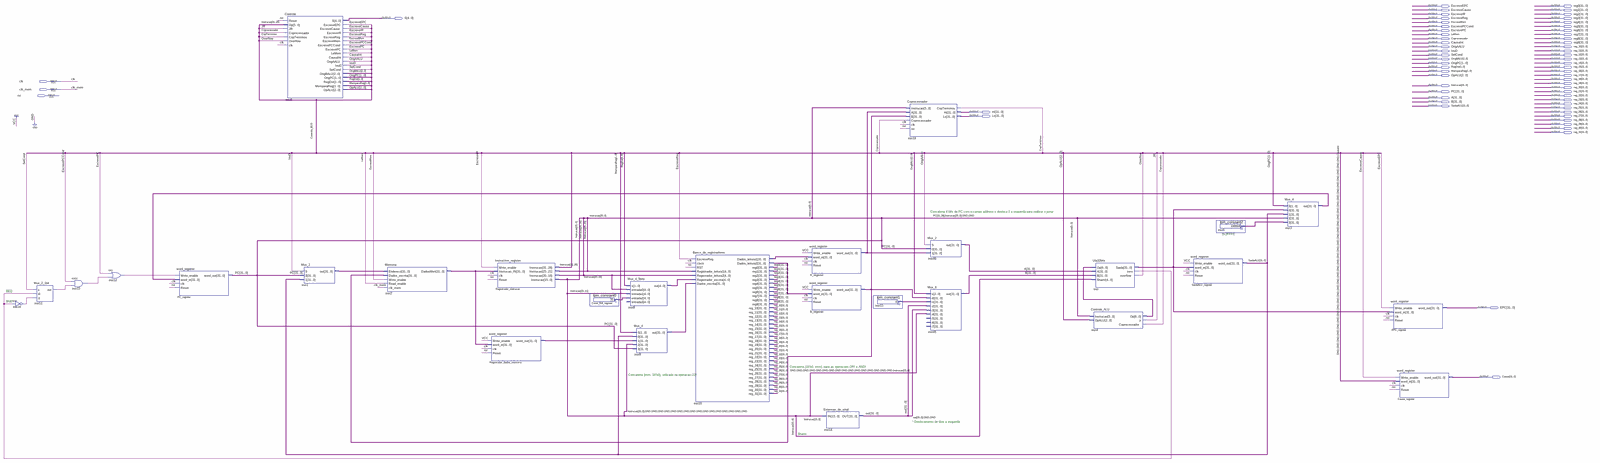
[diagram p0: schematic sheet, whole]
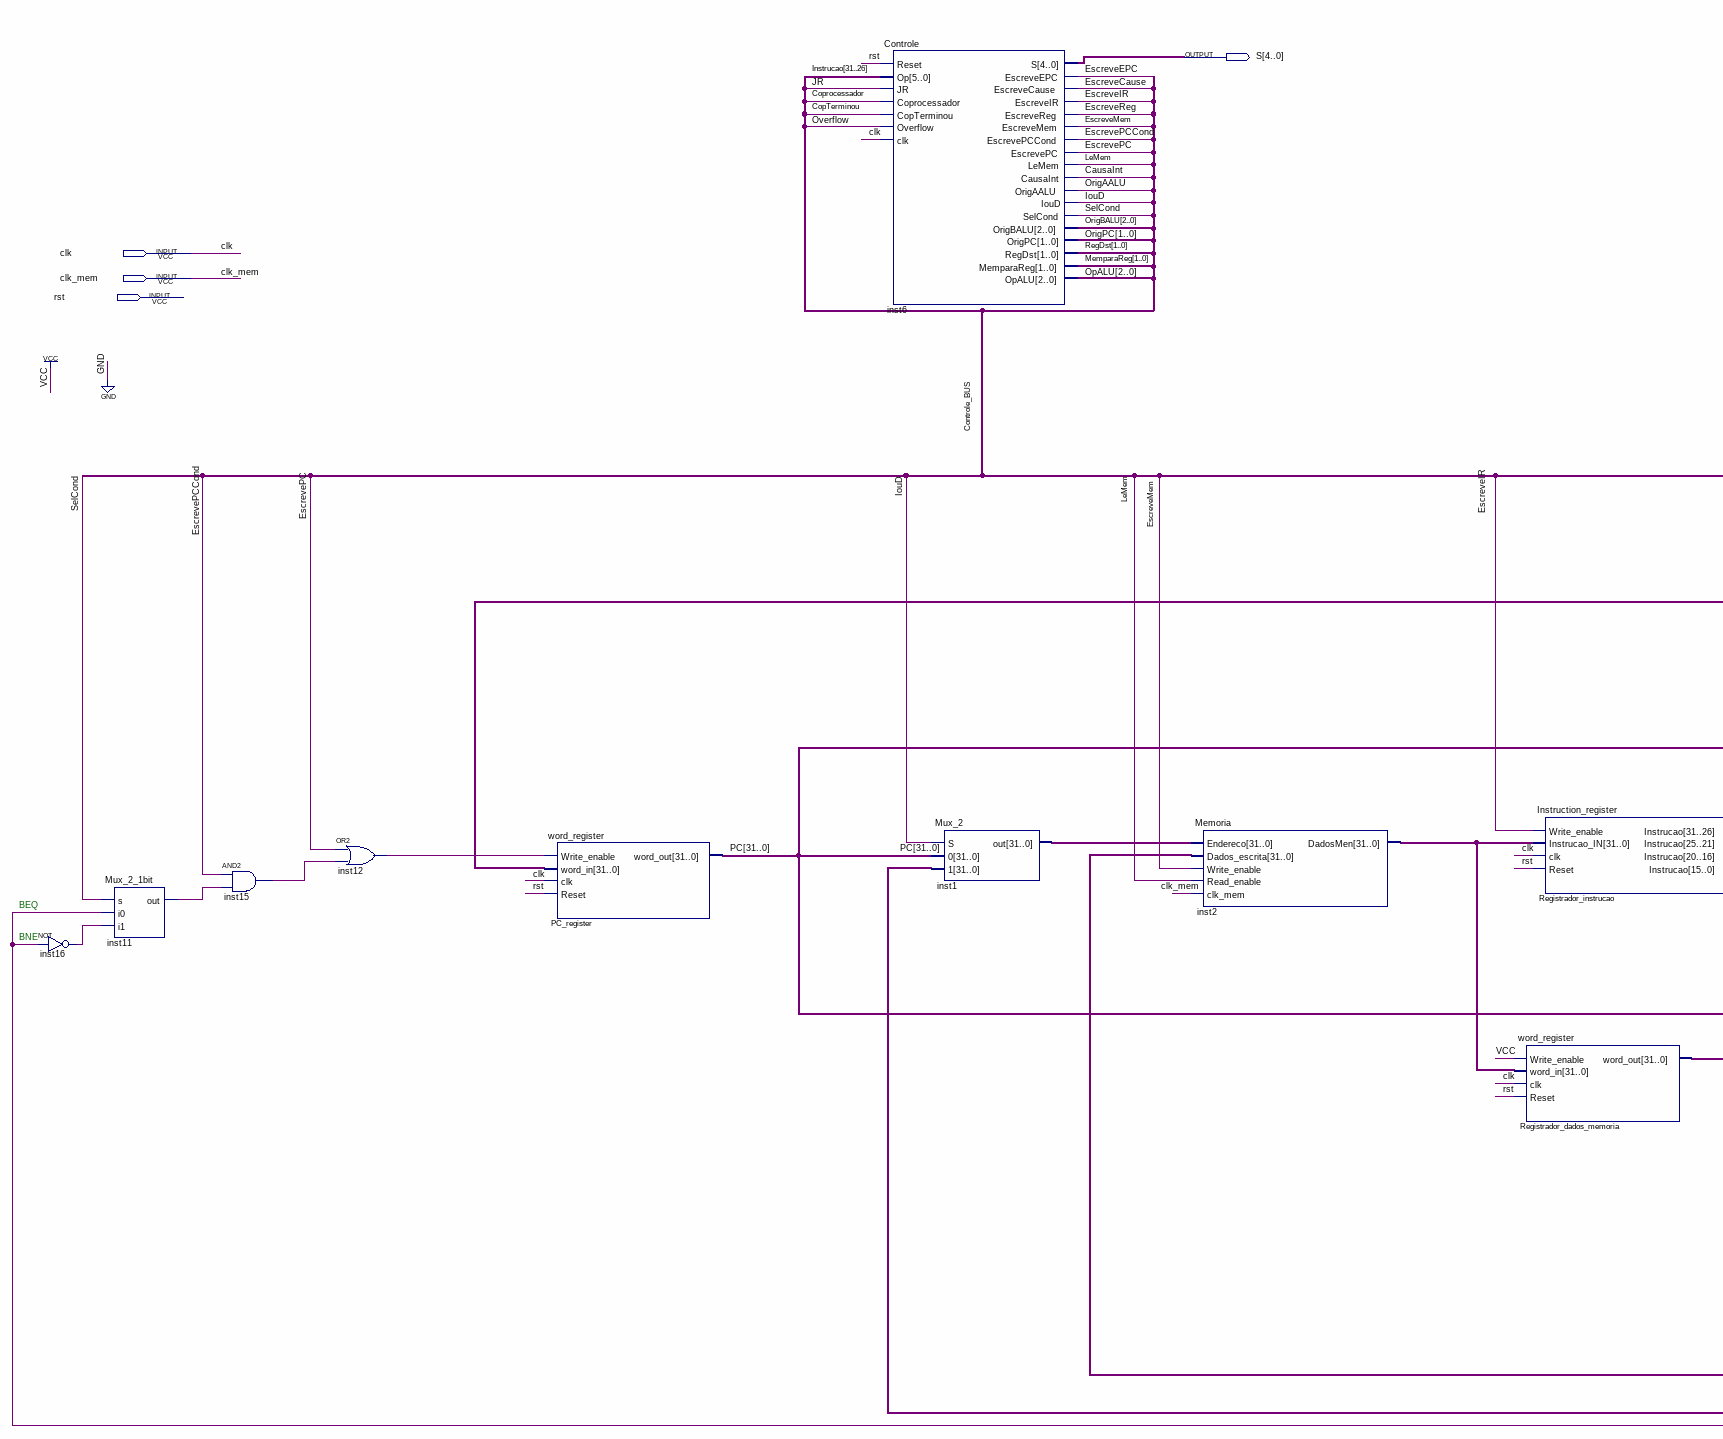
[diagram p1: schematic sheet, left part]
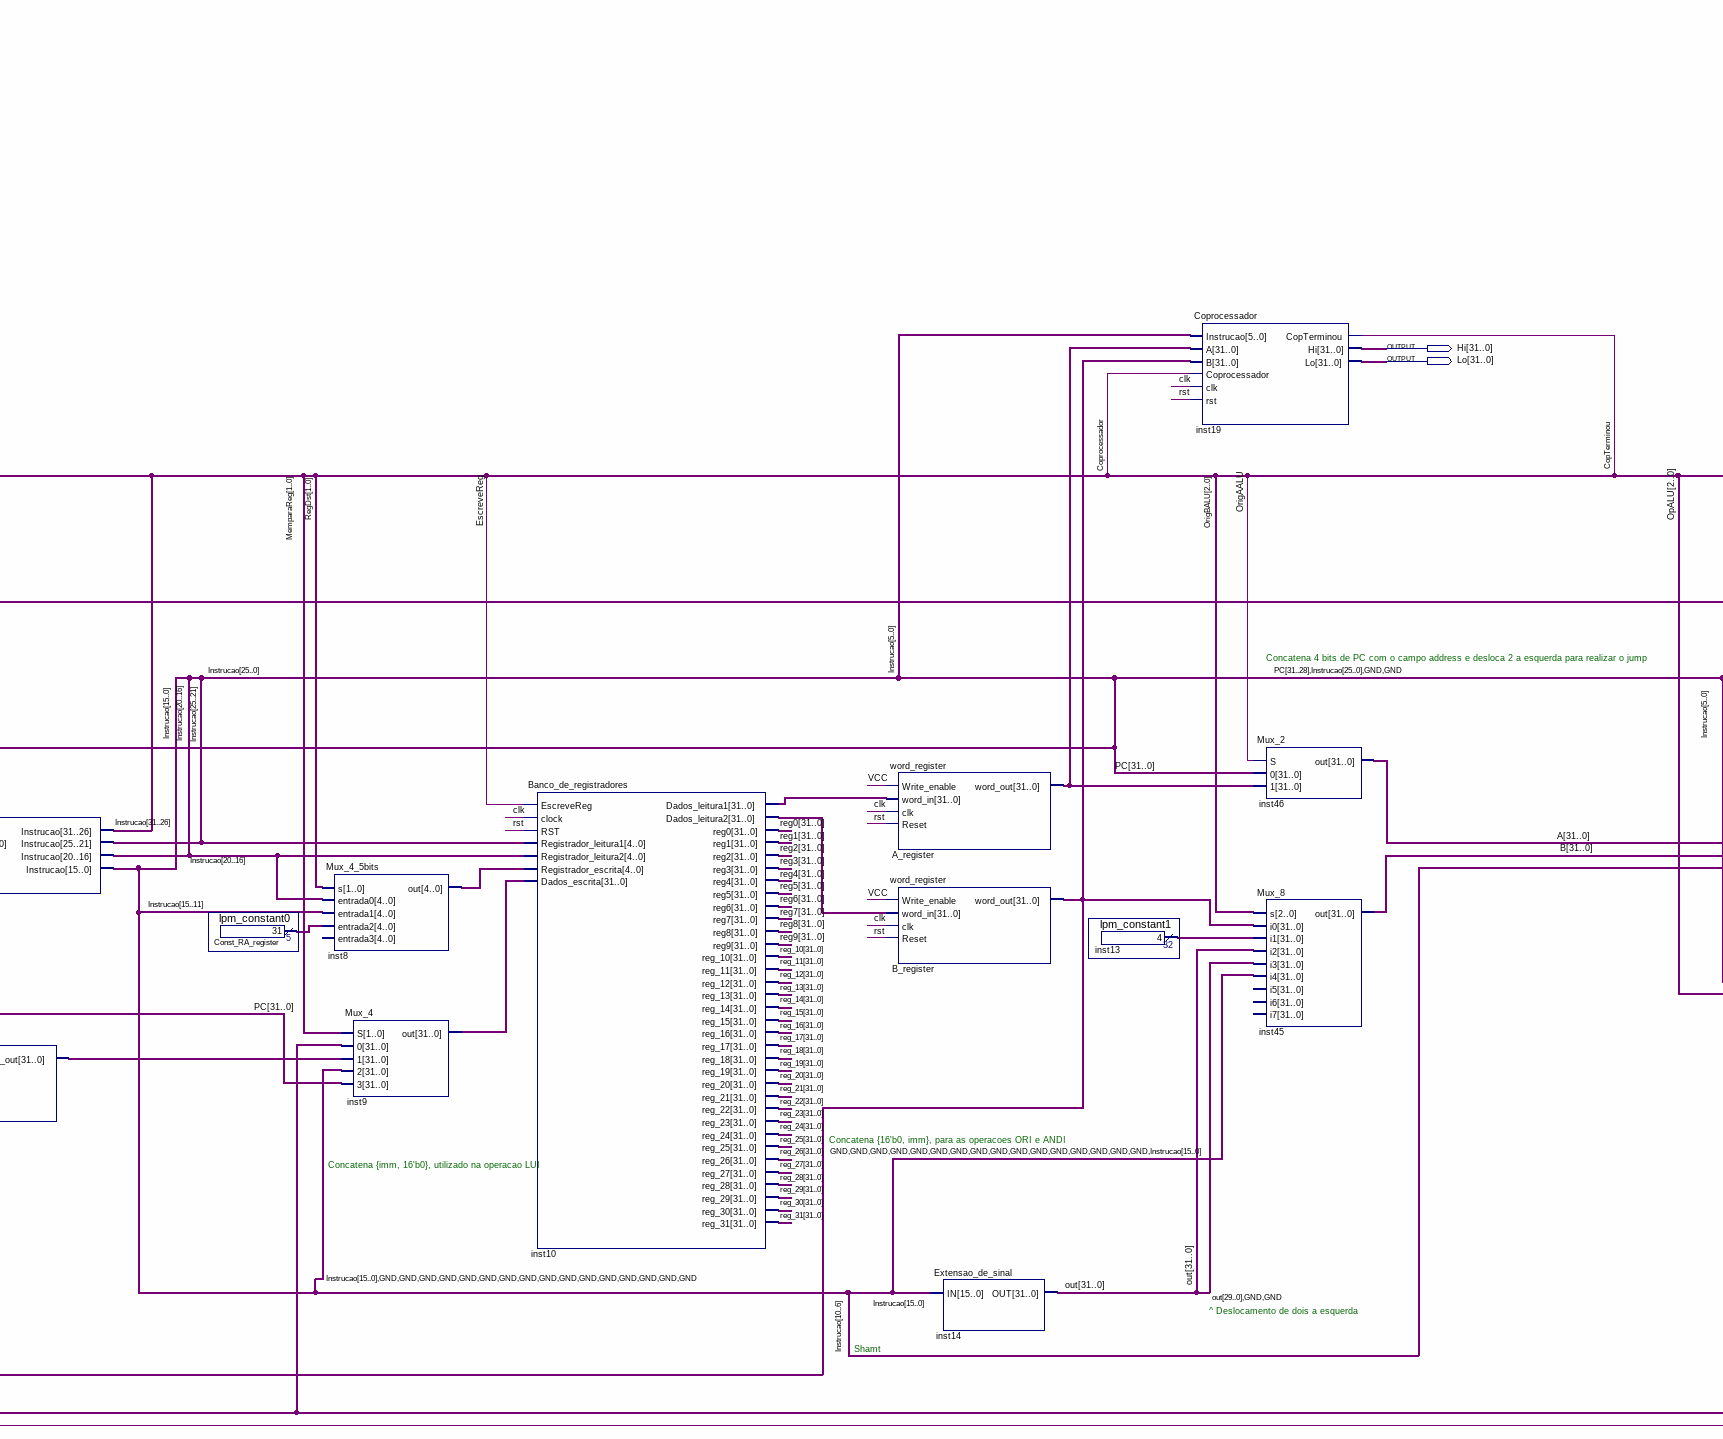
[diagram p2: schematic sheet, centre part]
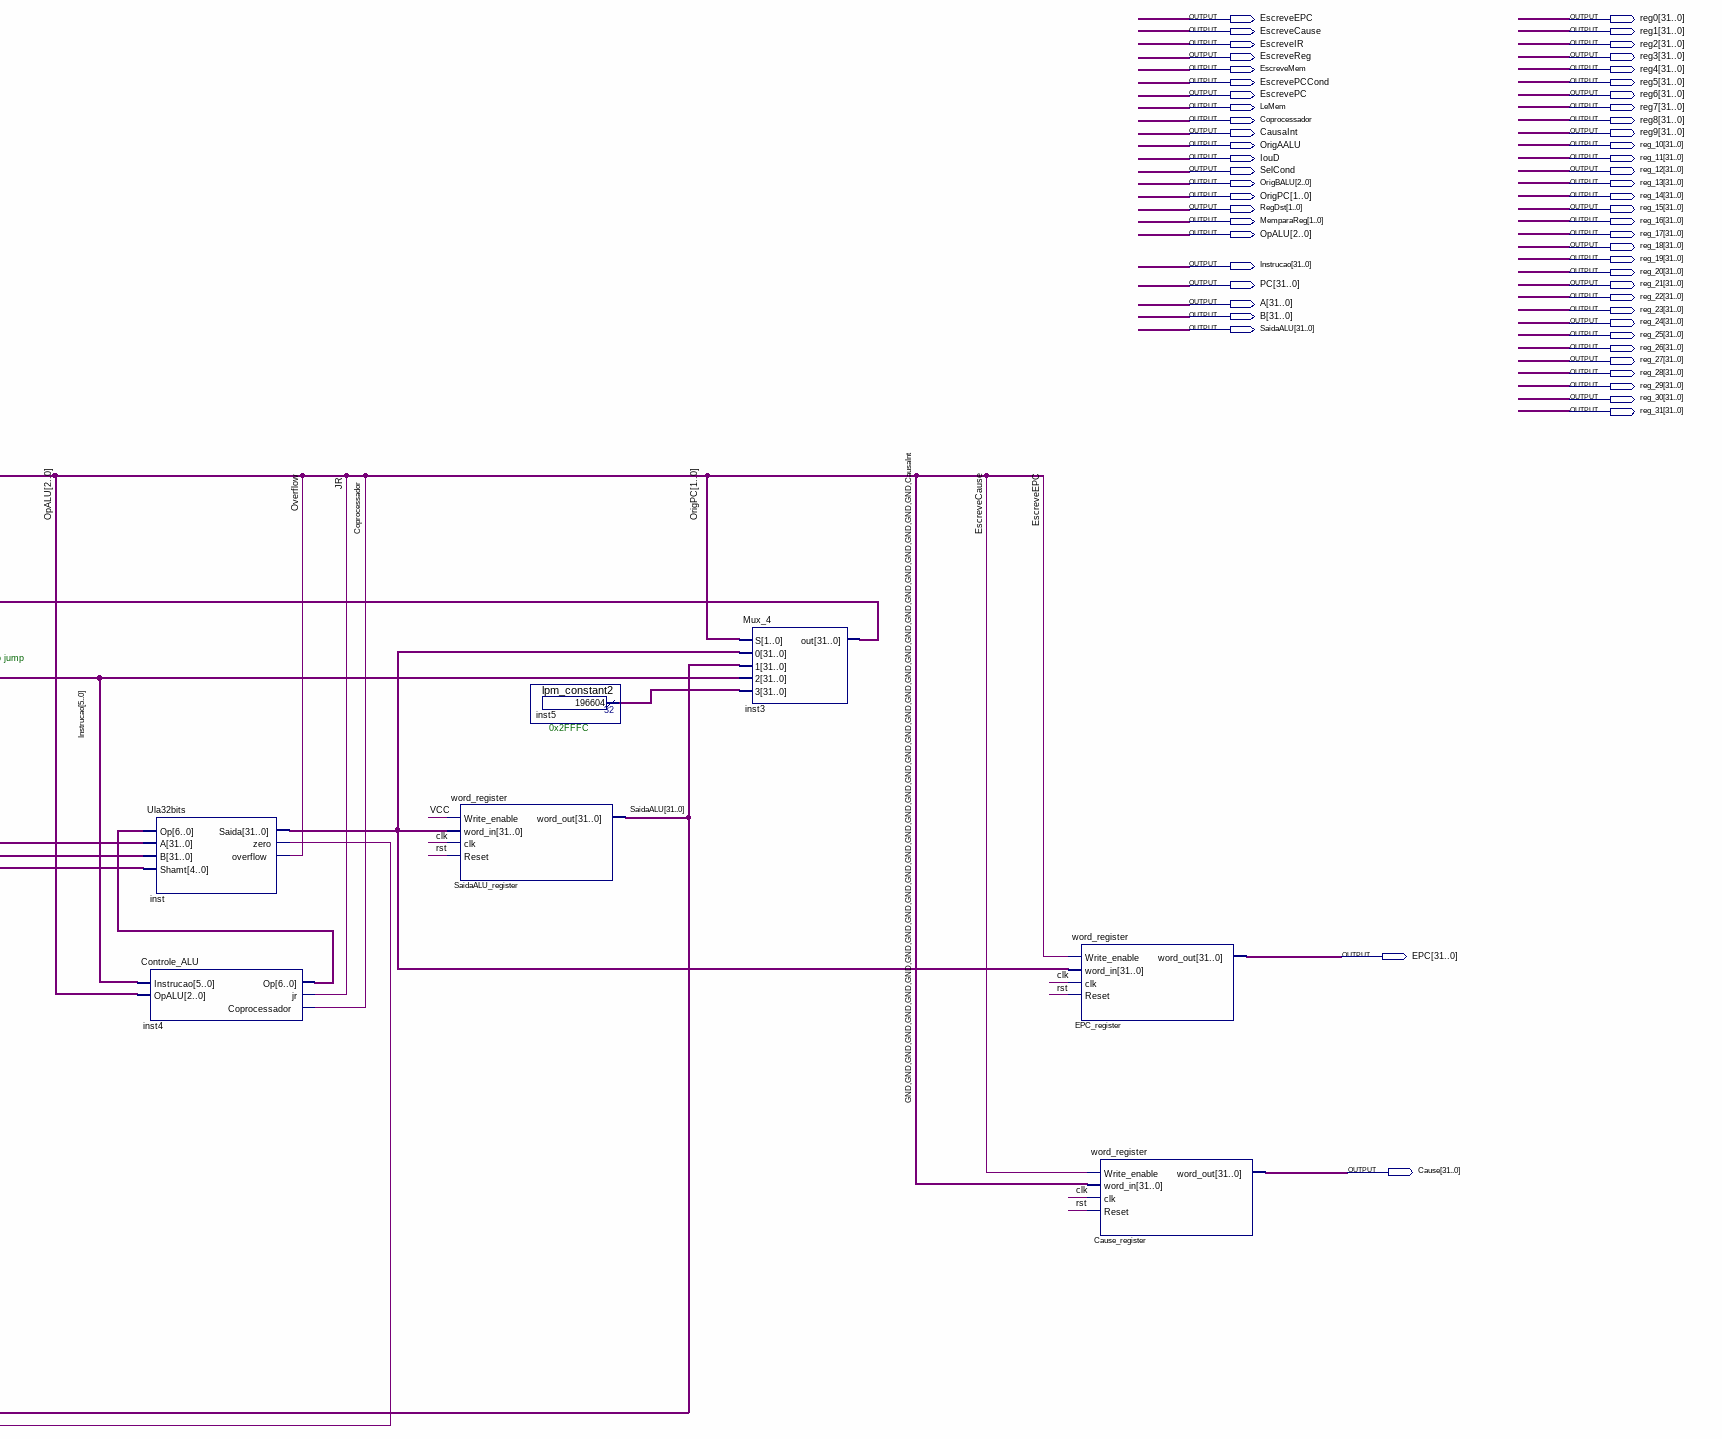
[diagram p3: schematic sheet, right part]
// Quartus schematic MIPS_Multiciclo.bdf as structural Verilog: 28 symbols, 63 pins
module MIPS_Multiciclo (
  input  clk,
  input  clk_mem,
  input  rst,
  output EscreveEPC,
  output [31:0] reg0,
  output EscreveCause,
  output [31:0] reg1,
  output EscreveIR,
  output [31:0] reg2,
  output [4:0] S,
  output EscreveReg,
  output [31:0] reg3,
  output EscreveMem,
  output [31:0] reg4,
  output EscrevePCCond,
  output [31:0] reg5,
  output EscrevePC,
  output [31:0] reg6,
  output LeMem,
  output [31:0] reg7,
  output Coprocessador,
  output [31:0] reg8,
  output CausaInt,
  output [31:0] reg9,
  output OrigAALU,
  output [31:0] reg_10,
  output IouD,
  output [31:0] reg_11,
  output SelCond,
  output [31:0] reg_12,
  output [2:0] OrigBALU,
  output [31:0] reg_13,
  output [1:0] OrigPC,
  output [31:0] reg_14,
  output [1:0] RegDst,
  output [31:0] reg_15,
  output [1:0] MemparaReg,
  output [31:0] reg_16,
  output [2:0] OpALU,
  output [31:0] reg_17,
  output [31:0] reg_18,
  output [31:0] reg_19,
  output [31:0] Instrucao,
  output [31:0] reg_20,
  output [31:0] PC,
  output [31:0] reg_21,
  output [31:0] reg_22,
  output [31:0] A,
  output [31:0] reg_23,
  output [31:0] B,
  output [31:0] reg_24,
  output [31:0] SaidaALU,
  output [31:0] reg_25,
  output [31:0] Hi,
  output [31:0] reg_26,
  output [31:0] Lo,
  output [31:0] reg_27,
  output [31:0] reg_28,
  output [31:0] reg_29,
  output [31:0] reg_30,
  output [31:0] reg_31,
  output [31:0] EPC,
  output [31:0] Cause
);

  wire CopTerminou, GND, inst11_out, inst12_out, inst15_out, inst16_out, inst_zero, JR, Overflow;
  wire [4:0] Const_RA_register_result, inst8_out;
  wire [6:0] inst4_op;
  wire [31:0] A_register_word_out, B_register_word_out, inst1_out, inst2_dadosmen, inst3_out, inst5_result,
       inst9_out, inst10_dados_leitura1, inst10_dados_leitura2, inst13_result, inst_saida, out,
       Registrador_dados_memoria_word_out;
  wire [31:0] Registrador_instrucao_instrucao_open;  // unused outputs

  not inst16 (inst16_out, inst_zero);
  Mux_2_1bit inst11 (.s(SelCond), .i0(inst_zero), .i1(inst16_out), .out(inst11_out));
  and inst15 (inst15_out, EscrevePCCond, inst11_out);
  or inst12 (inst12_out, EscrevePC, inst15_out);
  word_register PC_register (.Write_enable(inst12_out), .word_in(inst3_out), .clk(clk), .Reset(rst), .word_out(PC));
  Controle inst6 (
    .Reset(rst), .Op(Instrucao[31:26]), .JR(JR), .Coprocessador(Coprocessador), .CopTerminou(CopTerminou),
    .Overflow(Overflow), .clk(clk), .S(S), .EscreveEPC(EscreveEPC), .EscreveCause(EscreveCause),
    .EscreveIR(EscreveIR), .EscreveReg(EscreveReg), .EscreveMem(EscreveMem), .EscrevePCCond(EscrevePCCond),
    .EscrevePC(EscrevePC), .LeMem(LeMem), .CausaInt(CausaInt), .OrigAALU(OrigAALU), .IouD(IouD),
    .SelCond(SelCond), .OrigBALU(OrigBALU), .OrigPC(OrigPC), .RegDst(RegDst), .MemparaReg(MemparaReg),
    .OpALU(OpALU));
  Mux_2 inst1 (.S(IouD), .\0 (PC), .\1 (SaidaALU), .out(inst1_out));
  Memoria inst2 (
    .Endereco(inst1_out), .Dados_escrita(B_register_word_out), .Write_enable(EscreveMem),
    .Read_enable(LeMem), .clk_mem(clk_mem), .DadosMen(inst2_dadosmen));
  Instruction_register Registrador_instrucao (
    .Write_enable(EscreveIR), .Instrucao_IN(inst2_dadosmen), .clk(clk), .Reset(rst),
    .Instrucao({Instrucao[31:16], Registrador_instrucao_instrucao_open[15:0]}));
  word_register Registrador_dados_memoria (
    .Write_enable(1'b1), .word_in(inst2_dadosmen), .clk(clk), .Reset(rst),
    .word_out(Registrador_dados_memoria_word_out));
  lpm_constant0 Const_RA_register (.result(Const_RA_register_result));
  Mux_4_5bits inst8 (
    .s(RegDst), .entrada0(Instrucao[20:16]), .entrada1(Instrucao[15:11]),
    .entrada2(Const_RA_register_result), .out(inst8_out));  // open: entrada3
  Mux_4 inst9 (
    .S(MemparaReg), .\0 (SaidaALU), .\1 (Registrador_dados_memoria_word_out),
    .\2 ({Instrucao[15:0], {16{GND}}}), .\3 (PC), .out(inst9_out));
  Banco_de_registradores inst10 (
    .Dados_escrita(inst9_out), .clock(clk), .RST(rst), .Registrador_leitura1(Instrucao[25:21]),
    .Registrador_escrita(inst8_out), .EscreveReg(EscreveReg), .Registrador_leitura2(Instrucao[20:16]),
    .Dados_leitura1(inst10_dados_leitura1), .Dados_leitura2(inst10_dados_leitura2), .reg0(reg0), .reg1(reg1),
    .reg2(reg2), .reg3(reg3), .reg4(reg4), .reg5(reg5), .reg6(reg6), .reg7(reg7), .reg8(reg8), .reg9(reg9),
    .reg_10(reg_10), .reg_11(reg_11), .reg_12(reg_12), .reg_13(reg_13), .reg_14(reg_14), .reg_15(reg_15),
    .reg_16(reg_16), .reg_17(reg_17), .reg_18(reg_18), .reg_19(reg_19), .reg_20(reg_20), .reg_21(reg_21),
    .reg_22(reg_22), .reg_23(reg_23), .reg_24(reg_24), .reg_25(reg_25), .reg_26(reg_26), .reg_27(reg_27),
    .reg_28(reg_28), .reg_29(reg_29), .reg_30(reg_30), .reg_31(reg_31));
  word_register A_register (
    .Write_enable(1'b1), .word_in(inst10_dados_leitura1), .clk(clk), .Reset(rst),
    .word_out(A_register_word_out));
  word_register B_register (
    .Write_enable(1'b1), .word_in(inst10_dados_leitura2), .clk(clk), .Reset(rst),
    .word_out(B_register_word_out));
  Extensao_de_sinal inst14 (.IN(Instrucao[15:0]), .OUT(out));
  lpm_constant1 inst13 (.result(inst13_result));
  Coprocessador inst19 (
    .Instrucao(Instrucao[5:0]), .A(A_register_word_out), .B(B_register_word_out),
    .Coprocessador(Coprocessador), .clk(clk), .rst(rst), .CopTerminou(CopTerminou), .Hi(Hi), .Lo(Lo));
  Mux_2 inst46 (.S(OrigAALU), .\0 (PC), .\1 (A_register_word_out), .out(A));
  Mux_8 inst45 (
    .s(OrigBALU), .i0(B_register_word_out), .i1(inst13_result), .i2(out), .i3({out[29:0], {2{GND}}}),
    .i4({{16{GND}}, Instrucao[15:0]}), .out(B));  // open: i5, i6, i7
  Ula32bits inst (
    .Op(inst4_op), .A(A), .B(B), .Shamt(Instrucao[10:6]), .Saida(inst_saida), .zero(inst_zero),
    .overflow(Overflow));
  Controle_ALU inst4 (.Instrucao(Instrucao[5:0]), .OpALU(OpALU), .Op(inst4_op), .jr(JR), .Coprocessador(Coprocessador));
  word_register SaidaALU_register (
    .Write_enable(1'b1), .word_in(inst_saida), .clk(clk), .Reset(rst), .word_out(SaidaALU));
  lpm_constant2 inst5 (.result(inst5_result));
  Mux_4 inst3 (
    .S(OrigPC), .\0 (inst_saida), .\1 (SaidaALU), .\2 ({PC[31:28], Instrucao[25:0], {2{GND}}}),
    .\3 (inst5_result), .out(inst3_out));
  word_register EPC_register (.Write_enable(EscreveEPC), .word_in(inst_saida), .clk(clk), .Reset(rst), .word_out(EPC));
  word_register Cause_register (
    .Write_enable(EscreveCause), .word_in({{31{GND}}, CausaInt}), .clk(clk), .Reset(rst), .word_out(Cause));
  // also tied to GND on the sheet: GND

  // Notes on the sheet:
  //   Concatena 4 bits de PC com o campo address e desloca 2 a esquerda para realizar o jump
  //   0x2FFFC
  //   BEQ
  //   BNE
  //   Concatena {16'b0, imm}, para as operacoes ORI e ANDI
  //   Concatena {imm, 16'b0}, utilizado na operacao LUI
  //   ^ Deslocamento de dois a esquerda
  //   Shamt
endmodule
